# Altium schematic sheet Sheet1.SchDoc
size A4
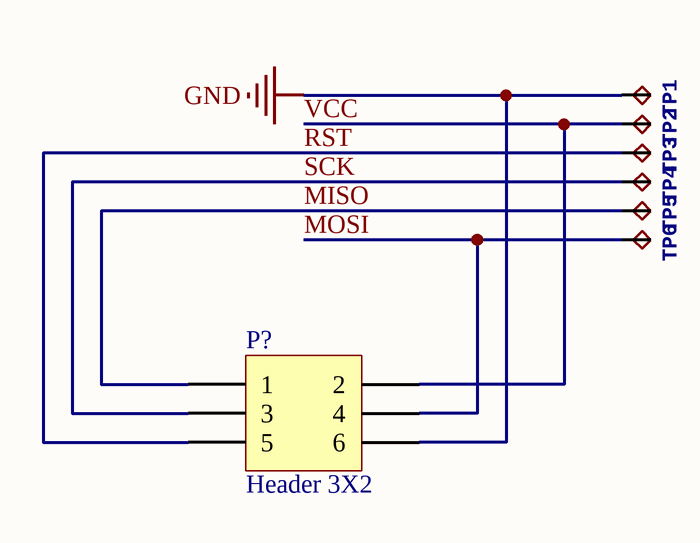
[diagram p0: Sheet1.SchDoc]

## Parts
P?  Header 3X2  [HDR2X3]
TP1  Test pad  [TP15R]  (value not drawn)
TP2  Test pad  [TP15R]  (value not drawn)
TP3  Test pad  [TP15R]  (value not drawn)
TP4  Test pad  [TP15R]  (value not drawn)
TP5  Test pad  [TP15R]  (value not drawn)
TP6  Test pad  [TP15R]  (value not drawn)

## Nets
GND: P?.6 TP1.TP
MISO: P?.1 TP5.TP
MOSI: P?.4 TP6.TP
RST: P?.5 TP3.TP
SCK: P?.3 TP4.TP
VCC: P?.2 TP2.TP

## Library data of the parts
P? = Header 3X2: Header, 3-Pin, Dual row; LatestRevisionDate: 17-Jul-2002; LatestRevisionNote: Re-released for DXP Platform.; Publisher: Altium Limited
TP1-TP6 = TPTP15R